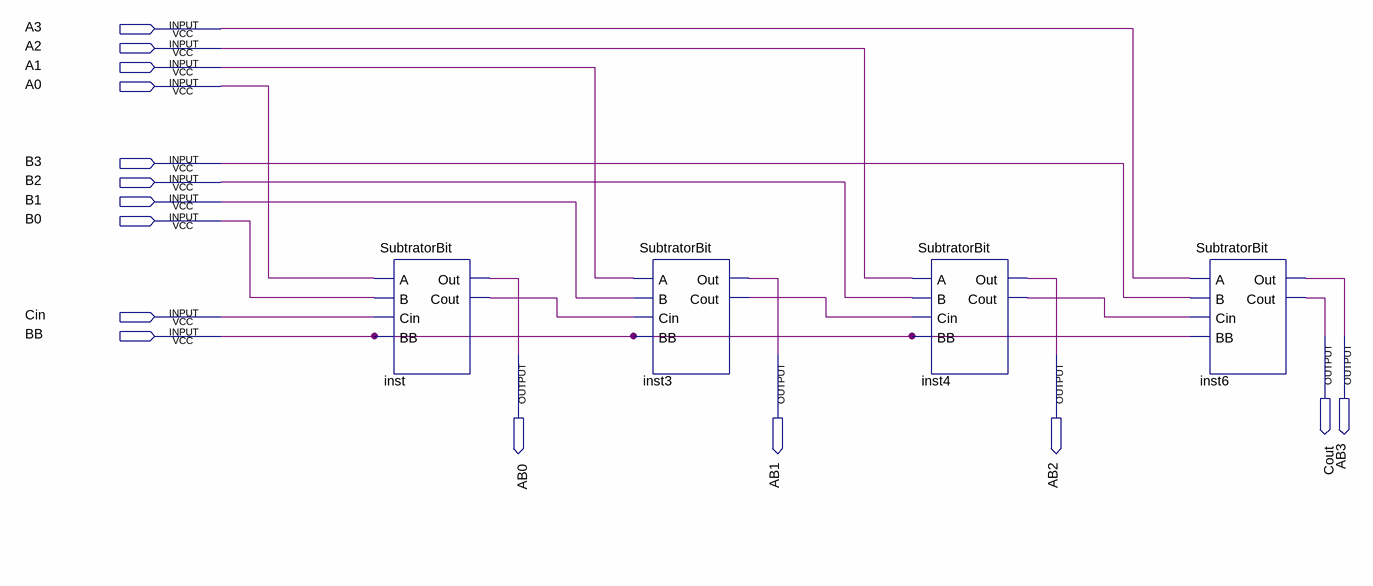
[diagram p0: schematic sheet]
// Quartus schematic SubtratorCompleto.bdf as structural Verilog: 4 symbols, 15 pins
module SubtratorCompleto (
  input  A3,
  input  A2,
  input  A1,
  input  A0,
  input  B3,
  input  B2,
  input  B1,
  input  B0,
  input  Cin,
  input  BB,
  output Cout,
  output AB3,
  output AB0,
  output AB1,
  output AB2
);

  wire inst3_cout, inst4_cout, inst_cout;

  SubtratorBit inst (.A(A0), .B(B0), .Cin(Cin), .BB(BB), .Out(AB0), .Cout(inst_cout));
  SubtratorBit inst3 (.A(A1), .B(B1), .Cin(inst_cout), .BB(BB), .Out(AB1), .Cout(inst3_cout));
  SubtratorBit inst4 (.A(A2), .B(B2), .Cin(inst3_cout), .BB(BB), .Out(AB2), .Cout(inst4_cout));
  SubtratorBit inst6 (.A(A3), .B(B3), .Cin(inst4_cout), .BB(BB), .Out(AB3), .Cout(Cout));
endmodule
